# EAGLE design ESC_BOARD (EAGLE 9.6.2)

## Sheet 1 of 2
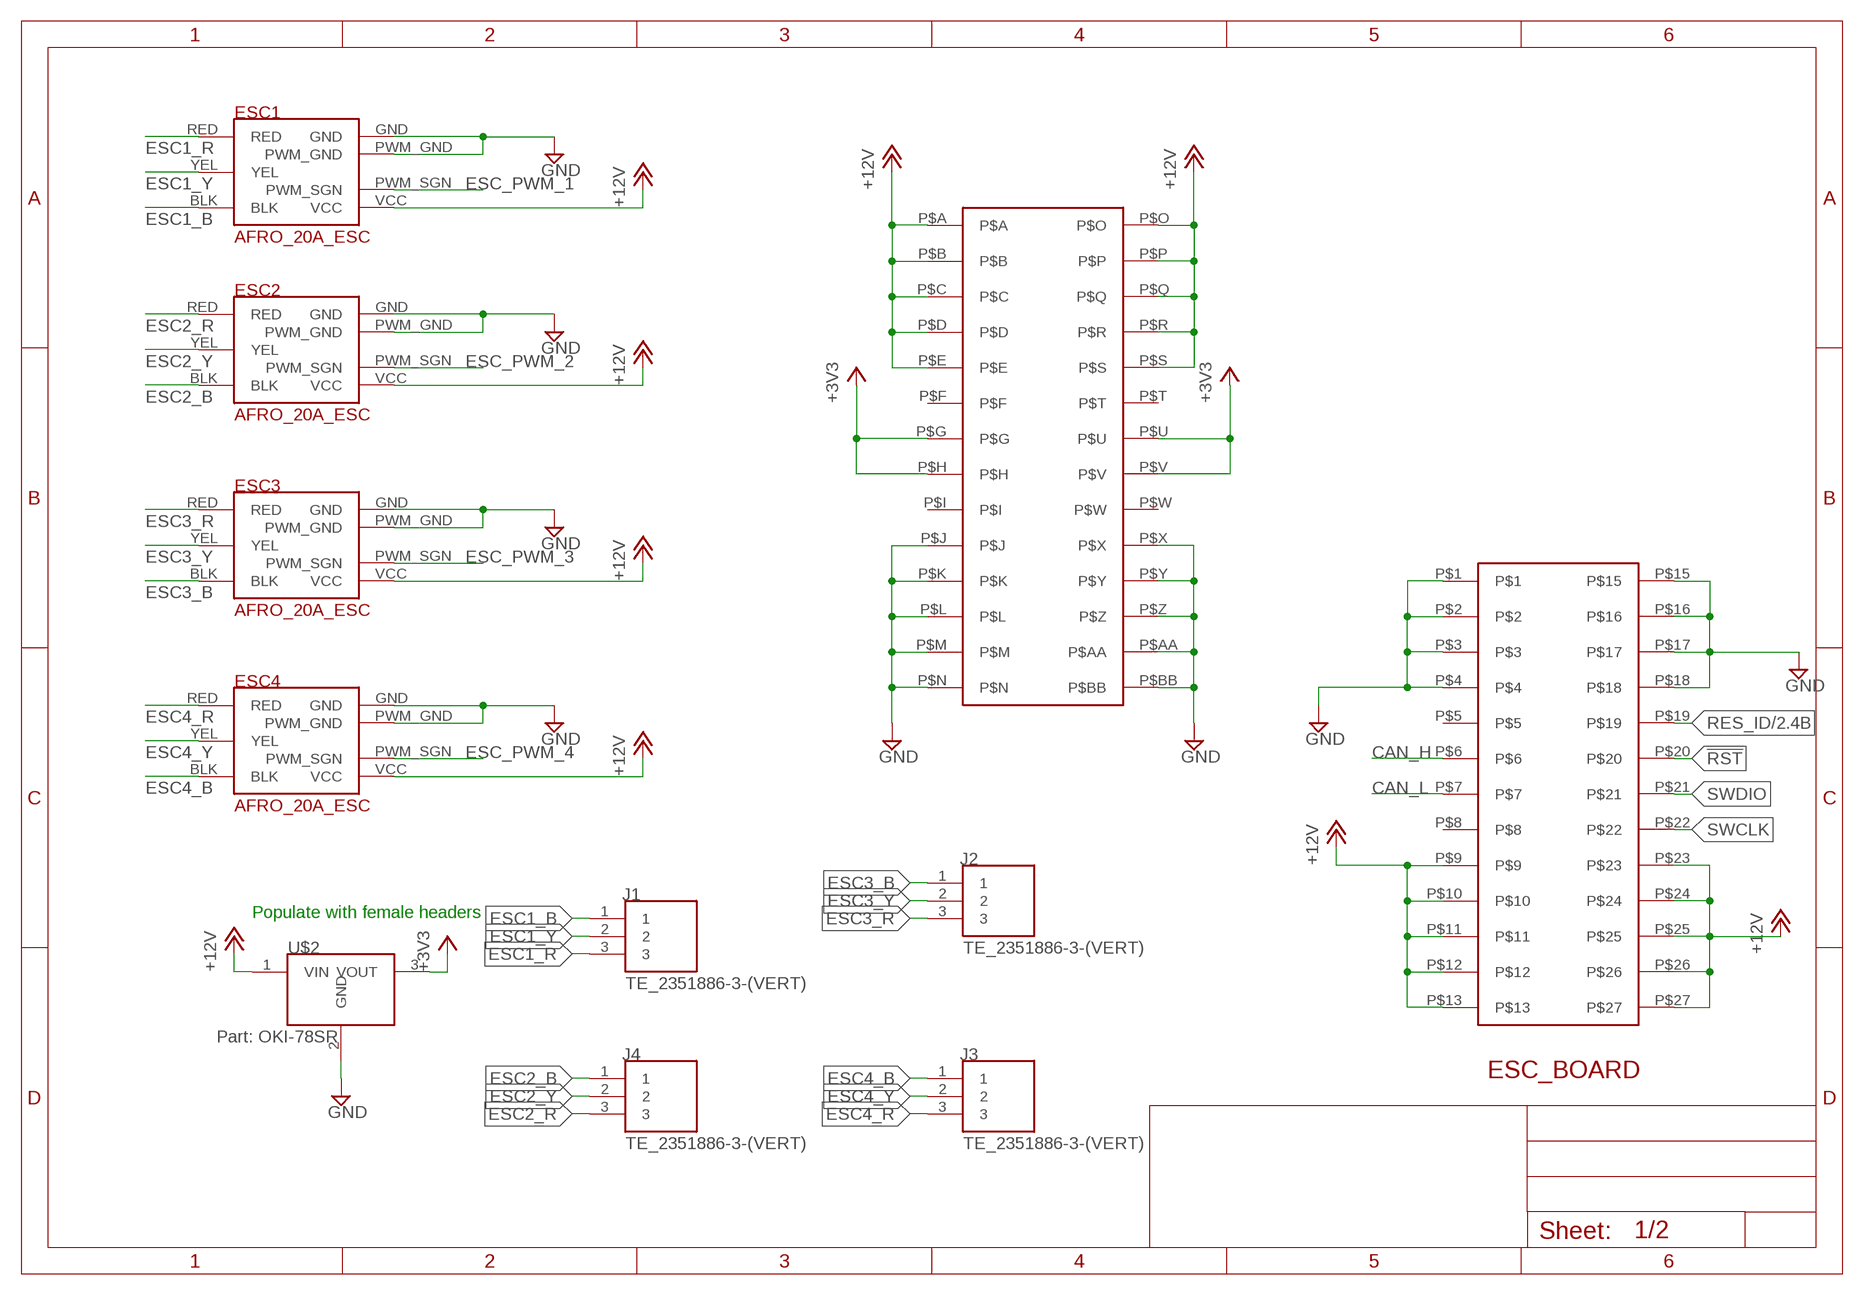
[diagram p0: schematic, sheet 1]

### Parts
ESC1  AFRO_20A_ESC  [AFRO_20A_ESC]
ESC2  AFRO_20A_ESC  [AFRO_20A_ESC]
ESC3  AFRO_20A_ESC  [AFRO_20A_ESC]
ESC4  AFRO_20A_ESC  [AFRO_20A_ESC]
J1  TE_2351886-3-(VERT)  [TE_2351886-3-(VERT)]
J2  TE_2351886-3-(VERT)  [TE_2351886-3-(VERT)]
J3  TE_2351886-3-(VERT)  [TE_2351886-3-(VERT)]
J4  TE_2351886-3-(VERT)  [TE_2351886-3-(VERT)]
U$2  MURATA-DC-DC  [MURATA-DC-DC]
U$6  ESC2BACKPLANE  [ESC2BACKPLANE_WHOLE]

### Nets
!RST [gpio]: U$6.P$20 ; also sheet 2
+3V3 [3.3V power]: U$2.3(VOUT) U$6.P$G U$6.P$H U$6.P$U U$6.P$V ; also sheet 2
+12V [12V power]: ESC1.VCC ESC2.VCC ESC3.VCC ESC4.VCC U$2.1(VIN) U$6.P$9 U$6.P$10 U$6.P$11 U$6.P$12 U$6.P$13 U$6.P$23 U$6.P$24 U$6.P$25 U$6.P$26 U$6.P$27 U$6.P$A U$6.P$B U$6.P$C U$6.P$D U$6.P$E U$6.P$O U$6.P$P U$6.P$Q U$6.P$R U$6.P$S
CAN_H [diff]: U$6.P$6 ; also sheet 2
CAN_L [diff]: U$6.P$7 ; also sheet 2
ESC1_B [motor phase]: ESC1.BLK J1.1
ESC1_R [motor phase]: ESC1.RED J1.3
ESC1_Y [motor phase]: ESC1.YEL J1.2
ESC2_B [motor phase]: ESC2.BLK J4.1
ESC2_R [motor phase]: ESC2.RED J4.3
ESC2_Y [motor phase]: ESC2.YEL J4.2
ESC3_B [motor phase]: ESC3.BLK J2.1
ESC3_R [motor phase]: ESC3.RED J2.3
ESC3_Y [motor phase]: ESC3.YEL J2.2
ESC4_B [motor phase]: ESC4.BLK J3.1
ESC4_R [motor phase]: ESC4.RED J3.3
ESC4_Y [motor phase]: ESC4.YEL J3.2
ESC_PWM_1 [gpio]: ESC1.PWM_SGN ; also sheet 2
ESC_PWM_2 [gpio]: ESC2.PWM_SGN ; also sheet 2
ESC_PWM_3 [gpio]: ESC3.PWM_SGN ; also sheet 2
ESC_PWM_4 [gpio]: ESC4.PWM_SGN ; also sheet 2
GND: ESC1.GND ESC1.PWM_GND ESC2.GND ESC2.PWM_GND ESC3.GND ESC3.PWM_GND ESC4.GND ESC4.PWM_GND U$2.2(GND) U$6.P$1 U$6.P$2 U$6.P$3 U$6.P$4 U$6.P$15 U$6.P$16 U$6.P$17 U$6.P$18 U$6.P$AA U$6.P$BB U$6.P$J U$6.P$K U$6.P$L U$6.P$M U$6.P$N U$6.P$X U$6.P$Y U$6.P$Z ; also sheet 2
RES_ID [gpio]: U$6.P$19 ; also sheet 2
SWCLK [gpio]: U$6.P$22 ; also sheet 2
SWDIO [gpio]: U$6.P$21 ; also sheet 2
Unconnected: U$6.P$5 U$6.P$8 U$6.P$F U$6.P$I U$6.P$T U$6.P$W

### Notes on the sheet
- Populate with female headers

## Sheet 2 of 2
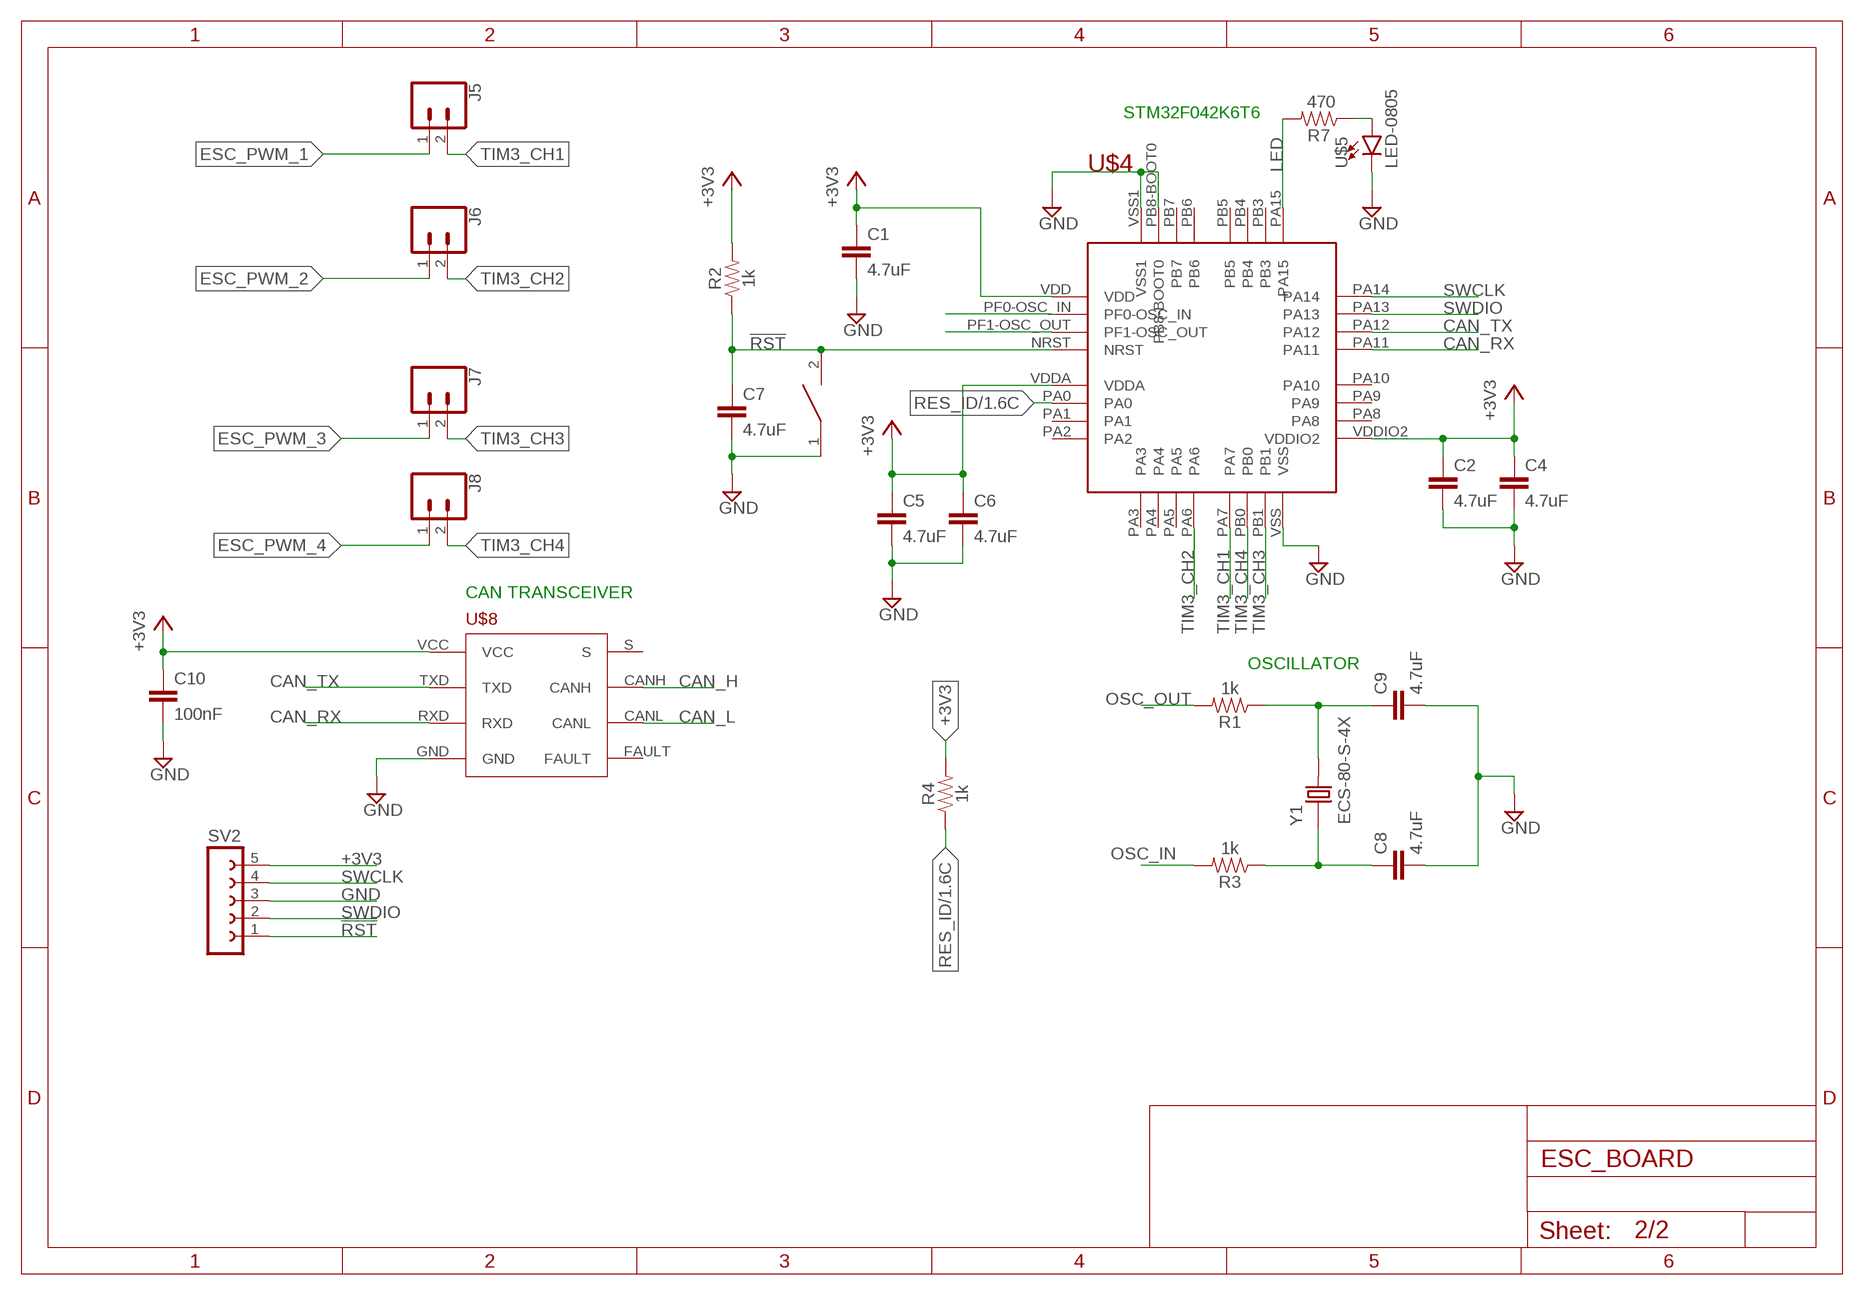
[diagram p1: schematic, sheet 2]

### Parts
C1  4.7uF  4.7UF0603  [0603]
C2  4.7uF  4.7UF0603  [0603]
C4  4.7uF  4.7UF0603  [0603]
C5  4.7uF  4.7UF0603  [0603]
C6  4.7uF  4.7UF0603  [0603]
C7  4.7uF  4.7UF0603  [0603]
C8  4.7uF  4.7UF0603  [0603]
C9  4.7uF  4.7UF0603  [0603]
C10  100nF  4.7UF0603  [0603]
J5  CONN_02  [1X02]
J6  CONN_02  [1X02]
J7  CONN_02  [1X02]
J8  CONN_02  [1X02]
R1  1k  1KOHM-0603-1/10W-1%  [0603]
R2  1k  1KOHM-0603-1/10W-1%  [0603]
R3  1k  1KOHM-0603-1/10W-1%  [0603]
R4  1k  1KOHM-0603-1/10W-1%  [0603]
R7  470  RESISTOR0603  [0603]
SV2  FE05-1  [FE05-1]
U$3  DISCRETECOMPONENTS_SWITCH  [DISCRETECOMPONENTS_SW_2512]
U$4  STM32F042K6T6  [STM32F042K6T6]
U$5  LED-0805  [0805]
U$8  TCAN337D  [TCAN337D]
Y1  ECS-80-S-4X  [XTAL_ECS-80-S-4X]

### Nets
!RST [gpio]: C7.1 R2.1 SV2.1 U$3.2 U$4.NRST ; also sheet 1
+3V3 [3.3V power]: C1.1 C2.1 C4.1 C5.1 C6.1 C10.1 R2.2 R4.2 SV2.5 U$4.VDD U$4.VDDA U$4.VDDIO2 U$8.VCC ; also sheet 1
CAN_H [diff]: U$8.CANH ; also sheet 1
CAN_L [diff]: U$8.CANL ; also sheet 1
CAN_RX [gpio]: U$4.PA11 U$8.RXD
CAN_TX [gpio]: U$4.PA12 U$8.TXD
ESC_PWM_1 [gpio]: J5.1 ; also sheet 1
ESC_PWM_2 [gpio]: J6.1 ; also sheet 1
ESC_PWM_3 [gpio]: J7.1 ; also sheet 1
ESC_PWM_4 [gpio]: J8.1 ; also sheet 1
GND: C1.2 C2.2 C4.2 C5.2 C6.2 C7.2 C8.2 C9.2 C10.2 SV2.3 U$3.1 U$4.PB8-BOOT0 U$4.VSS U$4.VSS1 U$5.C U$8.GND ; also sheet 1
LED [gpio]: R7.2 U$4.PA15
N$1: C9.1 R1.1 Y1.2
N$2: C8.1 R3.1 Y1.1
N$24: R7.1 U$5.A
OSC_IN [gpio]: R3.2 U$4.PF0-OSC_IN
OSC_OUT [gpio]: R1.2 U$4.PF1-OSC_OUT
RES_ID [gpio]: R4.1 U$4.PA0 ; also sheet 1
SWCLK [gpio]: SV2.4 U$4.PA14 ; also sheet 1
SWDIO [gpio]: SV2.2 U$4.PA13 ; also sheet 1
TIM3_CH1 [gpio]: J5.2 U$4.PA7
TIM3_CH2 [gpio]: J6.2 U$4.PA6
TIM3_CH3 [gpio]: J7.2 U$4.PB1
TIM3_CH4 [gpio]: J8.2 U$4.PB0
Unconnected: U$4.PA1 U$4.PA2 U$4.PA3 U$4.PA4 U$4.PA5 U$4.PA8 U$4.PA9 U$4.PA10 U$4.PB3 U$4.PB4 U$4.PB5 U$4.PB6 U$4.PB7 U$8.FAULT U$8.S

### Notes on the sheet
- STM32F042K6T6
- CAN TRANSCEIVER
- OSCILLATOR

## Library data of the parts
C1 C2 C4-C9 = SparkFun-Capacitors:4.7UF: 4.7µF ceramic capacitors A capacitor is a passive two-terminal electrical component used to store electrical energy temporarily in an electric field.; PROD_ID: CAP-08280
C10 = SparkFun-Capacitors:4.7UF: 4.7µF ceramic capacitors A capacitor is a passive two-terminal electrical component used to store electrical energy temporarily in an electric field.; PROD_ID: CAP-08280; VALUE: 4.7uF
ESC1-ESC4 = afro_20A_esc:AFRO_20A_ESC
J1-J4 = TE 3 pin 3.5mm:TE_2351886-3-(VERT)
J5-J8 = SparkFun-Connectors:CONN_02: Multi connection point. Often used as Generic Header-pin footprint for 0.1 inch spaced/style header connections On any of the 0.1 inch spaced packages, you can populate with these: Break Away Headers - Straight <https://www.sparkfun.com/products/116> (PRT-00116) Break Away Male Headers - Right Angle <https://www.sparkfun.com/products/553> (PRT-00553) Female Headers <https://www.sparkfun.com/products/115> (PRT-00115) Break Away Headers - Machine Pin <https://www.sparkfun.com/products/117> (PRT-00117) Break Away Female Headers - Swiss Machine Pin <https://www.sparkfun.com/products/743> (PRT-00743) For SCREWTERMINALS and SPRING TERMINALS visit here: Screw Terimnals on SparkFun.com <https://www.sparkfun.com/search/results?term=Screw+Terminals> (5mm/3.5mm/2.54mm spacing) This device is also useful as a general connection point to wire up your design to another part of your project. Our various solder wires solder well into these plated through hole pads. Hook-Up Wire - Assortment (Stranded, 22 AWG) <https://www.sparkfun.com/products/11375> (PRT-11375) Hook-Up Wire - Assortment (Solid Core, 22 AWG) <https://www.sparkfun.com/products/11367> (PRT-11367) View the entire wire category on our website here <https://www.sparkfun.com/categories/141> Special notes: Molex polarized connector foot print use with: PRT-08233 with associated crimp pins and housings. 2.54_SCREWTERM for use with PRT-10571. 3.5mm Screw Terminal footprints for PRT-08084 5mm Screw Terminal footprints for use with PRT-08432
R1-R4 = SparkFun-Resistors:1KOHM: 1kΩ resistor A resistor is a passive two-terminal electrical component that implements electrical resistance as a circuit element. Resistors act to reduce current flow, and, at the same time, act to lower voltage levels within circuits. - Wikipedia; PROD_ID: RES-07856
R7 = SparkFun-Resistors:RESISTOR: Generic Resistor Package
SV2 = con-lsta:FE05-1: FEMALE HEADER; OC_FARNELL: unknown; OC_NEWARK: unknown
U$2 = MURATA_3pin_dcdc:MURATA-DC-DC
U$3 = Push button - FSM2JMTR:DISCRETECOMPONENTS_SWITCH
U$4 = PI_Shield_Library:STM32F042K6T6
U$5 = LED-0805:LED-0805
U$6 = ESC_to_Backplane_Connectors_esc:ESC2BACKPLANE
U$8 = PI_Shield_Library:TCAN337D
Y1 = ECS-80-S-4X:ECS-80-S-4X: CRYSTAL T/H; DESCRIPTION: Crystal 8MHz Series 2-Pin HC-49/U; DIGI-KEY_PART_NUMBER: X1057-ND; DIGI-KEY_PURCHASE_URL: https://www.digikey.com/product-detail/en/ecs-inc/ECS-80-S-4X/X1057-ND/827549?utm_source=snapeda&utm_medium=aggregator&utm_campaign=symbol; MF: ECS International; MP: ECS-80-S-4X; PACKAGE: HC-49/US ECS International

## Net classes
1 gpio: width 0.203 mm
2 diff: width 0.203 mm, clearance 0.203 mm
3 3.3V power: width 0.61 mm
4 motor phase: width 1.778 mm
5 12V power: width 0.508 mm, clearance 0.508 mm

## Board
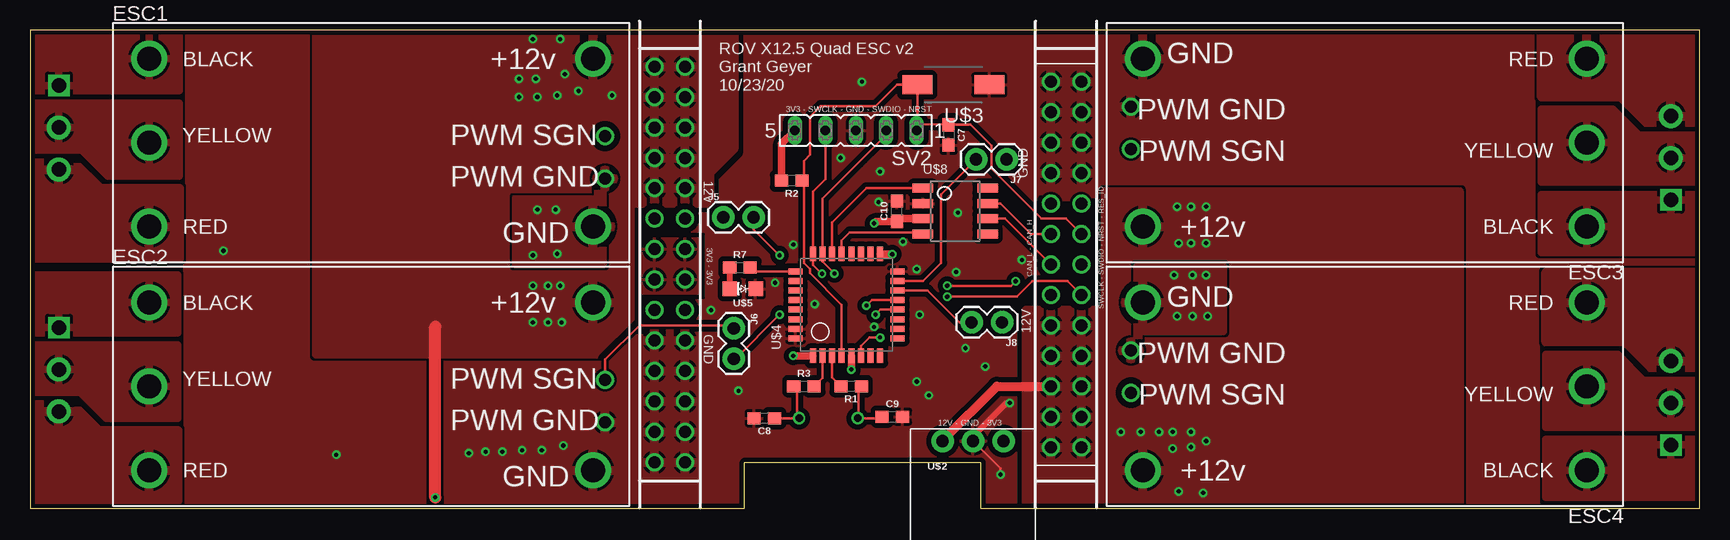
[diagram p2: board, top side]
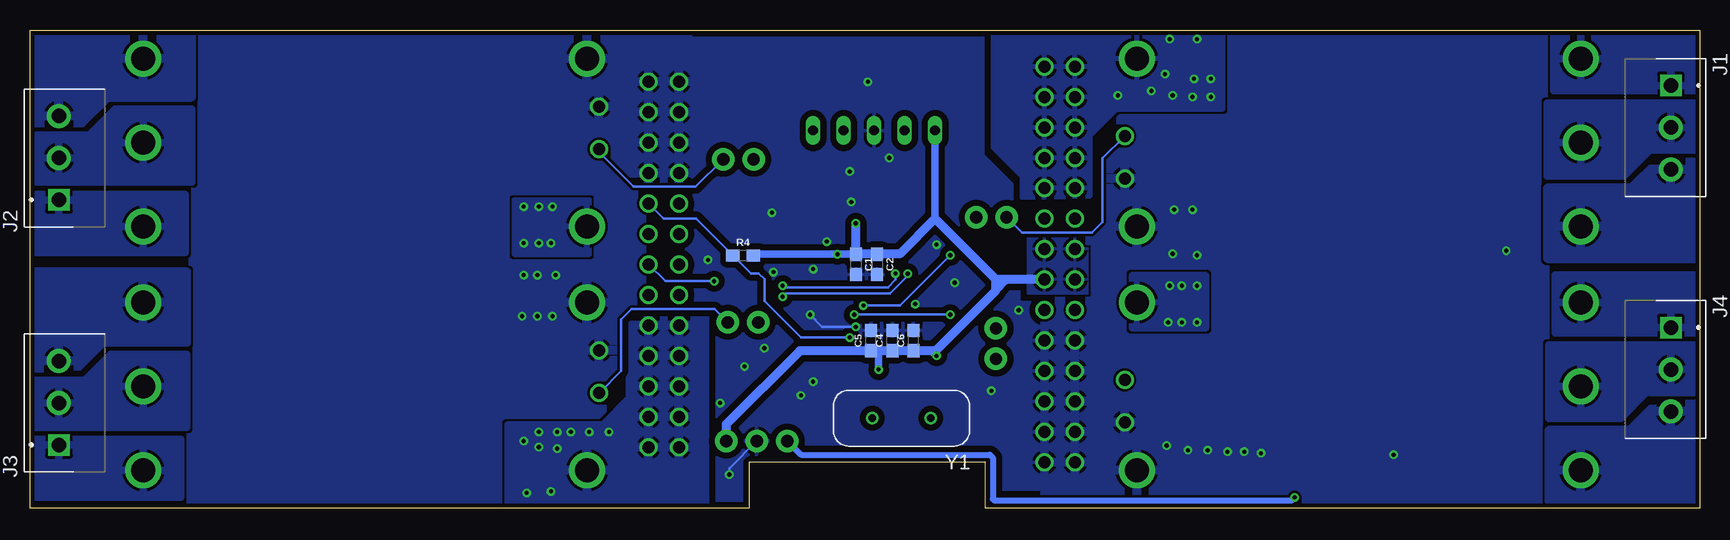
[diagram p3: board, bottom side, seen from below]

Size 139.19 x 39.88 mm. Coordinates in mm from the lower left corner, seen from the top.
Outline: 0,0 59.56,0 59.56,3.81 79.25,3.81 79.25,0 139.19,0 139.19,39.88 0,39.88 0,0
Copper layers (1*16): Top 0.0356mm / dielectric 1.5011mm / Bottom 0.0356mm
Design rules "ECE_Senior_Design": minimum track width 8mil, minimum drill 13mil, track to track 8mil, track to pad 8mil, pad to pad 6mil, via to via 8mil, smd to smd 6mil, copper to edge 15mil, drill to drill 8mil, minimum pad ring 7mil, minimum via ring 7mil, stop-mask expansion 3mil, vias tented up to drill 0mil, thermal gap 10mil

### Footprints (pad centres in the part's own frame; a part is rotated, then mirrored left to right if it is on the bottom)
0603 = smd 1.1 x 1: 1 -0.85,0; 2 0.85,0
AFRO_20A_ESC = drill 2: BLK -18,7; GND 19,-7; RED -18,-7; VCC 19,7; YEL -18,0 | drill 1: PWM_GND 20,-3; PWM_SGN 20,0.54
TE_2351886-3-(VERT) = drill 1.2 square: 1 -3.5,0 | drill 1.2 pad 2: 2 0,0; 3 3.5,0
1X02 = drill 1.016 pad 1.88: 1 0,0; 2 2.54,0
FE05-1 = drill 0.813 long: 1 -5.08,0; 2 -2.54,0; 3 0,0; 4 2.54,0; 5 5.08,0
MURATA-DC-DC = drill 1.016 pad 1.88: 1 -2.54,0; 2 0,0; 3 2.54,0
DISCRETECOMPONENTS_SW_2512 = smd 2.5 x 1.6: 1 -3,0; 2 3,0
STM32F042K6T6 = smd 1.2 x 0.5: NRST 0,3.2; PA0 0,1.6; PA1 0,0.8; PA2 0,0; PA8 8.5,0.8; PA9 8.5,1.6; PA10 8.5,2.4; PA11 8.5,3.2; PA12 8.5,4; PA13 8.5,4.8; PA14 8.5,5.6; PF0-OSC_IN 0,4.8; PF1-OSC_OUT 0,4; VDD 0,5.6; VDDA 0,2.4; VDDIO2 8.5,0 | smd 0.5 x 1.2: PA3 1.45,-1.45; PA4 2.25,-1.45; PA5 3.05,-1.45; PA6 3.85,-1.45; PA7 4.65,-1.45; PA15 7.05,7.05; PB0 5.45,-1.45; PB1 6.25,-1.45; PB3 6.25,7.05; PB4 5.45,7.05; PB5 4.65,7.05; PB6 3.85,7.05; PB7 3.05,7.05; PB8-BOOT0 2.25,7.05; VSS 7.05,-1.45; VSS1 1.45,7.05
0805 = smd 1.2 x 1.2: A 1.1,0; C -1.05,0
ESC2BACKPLANE_WHOLE = drill 1: P$1 1.27,31.75; P$2 3.81,31.75; P$3 6.35,31.75; P$4 8.89,31.75; P$5 11.43,31.75; P$6 13.97,31.75; P$7 16.51,31.75; P$8 19.05,31.75; P$9 21.59,31.75; P$10 24.13,31.75; P$11 26.67,31.75; P$12 29.21,31.75; P$13 31.75,31.75; P$15 1.27,34.29; P$16 3.81,34.29; P$17 6.35,34.29; P$18 8.89,34.29; P$19 11.43,34.29; P$20 13.97,34.29; P$21 16.51,34.29; P$22 19.05,34.29; P$23 21.59,34.29; P$24 24.13,34.29; P$25 26.67,34.29; P$26 29.21,34.29; P$27 31.75,34.29; P$A 0,-1.27; P$AA 30.48,1.27; P$B 2.54,-1.27; P$BB 33.02,1.27; P$C 5.08,-1.27; P$D 7.62,-1.27; P$E 10.16,-1.27; P$F 12.7,-1.27; P$G 15.24,-1.27; P$H 17.78,-1.27; P$I 20.32,-1.27; P$J 22.86,-1.27; P$K 25.4,-1.27; P$L 27.94,-1.27; P$M 30.48,-1.27; P$N 33.02,-1.27; P$O 0,1.27; P$P 2.54,1.27; P$Q 5.08,1.27; P$R 7.62,1.27; P$S 10.16,1.27; P$T 12.7,1.27; P$U 15.24,1.27; P$V 17.78,1.27; P$W 20.32,1.27; P$X 22.86,1.27; P$Y 25.4,1.27; P$Z 27.94,1.27
TCAN337D = smd 1.7 x 0.75: CANH 5.4,2.54; CANL 5.4,1.27; FAULT 5.4,0; GND 0,2.54; RXD 0,0; S 5.4,3.81; TXD 0,3.81; VCC 0,1.27
XTAL_ECS-80-S-4X = drill 0.63 pad 1.03: 1 -2.44,0; 2 2.44,0

### Placement (x,y rotation side)
C1  70.36,20.32 270 bottom
C2  68.58,20.32 270 bottom
C4  67.31,13.97 90 bottom
C5  69.09,13.97 90 bottom
C6  65.53,13.97 90 bottom
C7  76.58,31.11 270 top
C8  61.21,7.49 180 top
C9  71.88,7.62 0 top
C10  72.26,24.77 90 top
ESC1  27.94,30.48 0 top
ESC2  27.94,10.16 0 top
ESC3  111.76,30.48 180 top
ESC4  111.76,10.16 180 top
J1  2.41,31.75 270 bottom
J2  136.78,29.21 90 bottom
J3  136.78,8.76 90 bottom
J4  2.41,11.56 270 bottom
J5  57.78,24.26 0 top
J6  58.67,14.99 270 top
J7  81.41,29.08 180 top
J8  81.03,15.49 180 top
R1  68.45,10.16 180 top
R2  63.5,27.3 180 top
R3  64.52,10.16 0 top
R4  79.76,21.08 0 bottom
R7  59.18,20.07 0 top
SV2  68.83,31.5 180 top
U$2  78.61,5.59 0 top
U$3  76.96,35.31 180 top
U$4  70.87,12.7 90 top
U$5  59.44,18.29 180 top
U$6  53.34,36.83 270 top
U$8  74.42,22.86 0 top
Y1  66.55,7.49 180 bottom

### Tracks (layer width: path | path; a pad name or v marks a point on that pad's centre or on a via)
!RST
  Top 0.203: 64.52,27.47 64.52,28.96 65.02,29.46 65.02,32.64 65.91,33.53 70.48,33.53 72.26,35.31 U$3.2 73.96,31.54 SV2.1 74.42,32 C7.1 78.4,31.96 80.14,30.23 80.14,28.32 84.33,24.13 86.36,24.13 U$6.P$20 | 64.52,27.47 64.52,20.45 65.02,19.94 65.02,19.6 67.67,16.96 U$4.NRST | R2.1 64.52,27.47
+3V3  (via drill 0.35)
  Top 0.61: U$8.VCC 72.48,24.13 C10.1 70.52,23.91 v70.36,23.75 | U$4.VDD v63.63,12.7 | U$4.VDDIO2 71.85,21.2 v71.88,21.17 | U$4.VDDA 68.47,11.57 v68.45,11.56 | R2.2 62.65,30.39 SV2.5
  Bottom 0.61: C1.1 v71.88,21.17 78.82,21.17 R4.2 | SV2.5 63.75,24.13 | v63.63,12.7 64.05,13.12 64.6,13.12 | v68.45,11.56 68.45,13.12 | 57.78,19.05 58.67,18.16
  Bottom 0.762: U$2.3 81.15,6.99 75.02,13.12 C5.1 68.45,13.12 C4.1 C6.1 64.6,13.12 63.72,13.12 58.67,18.16 58.67,19.05 | v70.36,23.75 C1.1 C2.1 68.54,21.21 66.67,21.21 63.75,24.13 58.67,19.05 | U$6.P$V 57.78,19.05 58.67,19.05
  pour Top: 51.05,22.48 55.75,22.48 55.75,17.91 51.05,17.91
  pour Bottom: 56.01,22.48 51.05,22.48 51.05,17.91 56.01,17.91
+12V  (via drill 0.35)
  Top 0.762: U$2.1 76.07,5.63 80.6,10.16 U$6.P$11
  Top 1.016: v33.78,0.89 33.78,15.11
  Bottom 0.508: U$2.1 74.93,4.45 59.18,4.45 58.93,4.19 58.93,0.76 58.8,0.64 34.04,0.64 v33.78,0.89
  other vias: 44.2,39.12 44.58,36.2 42.16,35.81 42.29,34.29 45.72,34.8 90.93,6.35 92.58,6.35 94.11,6.35 95.25,6.35 96.77,6.35 96.77,5.08 95.25,4.95 95.76,1.4 40.77,34.29 40.77,35.81 43.94,34.42 48.51,34.42 41.91,39.12 98.04,5.59 97.79,1.27 44.2,18.54 43.18,18.54 41.91,18.54 41.91,15.49 43.18,15.49 44.32,15.49 95.76,22.1 96.77,22.1 98.04,22.1 98.04,25.15 96.77,25.15 95.63,25.15
  pour Top (isolate 0.406, rank 2): 23.88,40.89 58.67,40.89 58.67,29.97 56.64,27.94 56.64,25.4 50.04,25.4 50.04,15.24 47.62,12.83 23.88,12.83
  pour Top (isolate 0.406, rank 2): 83.06,16.51 89.66,16.51 89.66,26.42 119.13,26.42 119.13,-0.51 83.06,-0.51
  pour Bottom: 39.75,40.54 58.93,40.38 58.93,30.1 56.52,27.69 56.52,25.91 50.8,26.04 50.8,31.11 48.64,33.27 39.75,33.27
  pour Bottom: 82.93,16 89.15,16 89.15,9.14 91.44,6.86 99.31,6.86 99.31,-0.51 82.93,-0.51
  pour Bottom: 41.4,19.43 47.37,19.43 47.37,14.99 41.15,14.99 41.15,19.43 41.27,19.43
  pour Bottom: 98.55,21.21 92.58,21.21 92.58,25.65 98.81,25.65 98.81,21.21 98.68,21.21
CAN_H
  Top 0.203: U$8.CANH 80.9,25.4 83.44,22.86 U$6.P$6
CAN_L
  Top 0.203: U$8.CANL 81.28,24.13 U$6.P$7
CAN_RX
  Top 0.203: U$4.PA11 67.67,22.33 68.33,22.99 74.3,22.99 U$8.RXD
CAN_TX
  Top 0.203: U$4.PA12 66.87,23.81 69.72,26.67 U$8.TXD
ESC1_B
  pour Top: 12.45,34.8 -0.51,34.8 -0.51,39.62 12.45,39.62
  pour Bottom: 12.19,34.8 -0.76,34.8 -0.76,39.62 12.19,39.62
ESC1_R
  pour Bottom: 12.7,20.83 -0.25,20.83 -0.25,28.83 3.56,28.83 5.71,26.67 12.7,26.67
  pour Top: 12.45,20.83 -0.51,20.83 -0.51,28.83 3.68,28.83 5.84,26.67 12.45,26.67
ESC1_Y
  pour Bottom: 12.7,27.69 6.35,27.69 4.19,29.84 -0.25,29.84 -0.25,33.78 12.7,33.78
  pour Top: 12.45,27.69 6.48,27.69 4.32,29.84 -0.51,29.84 -0.51,33.78 12.45,33.78
ESC2_B
  pour Bottom: 12.06,14.61 -0.89,14.61 -0.89,19.43 12.06,19.43
  pour Top: 12.32,14.61 -0.64,14.61 -0.64,19.43 12.32,19.43
ESC2_R
  pour Top: 12.32,0.64 -0.64,0.64 -0.64,8.64 3.56,8.64 5.71,6.48 12.32,6.48
  pour Bottom: 12.57,0.64 -0.38,0.64 -0.38,8.64 3.68,8.64 5.84,6.48 12.57,6.48
ESC2_Y
  pour Top: 12.32,7.49 6.35,7.49 4.19,9.65 -0.64,9.65 -0.64,13.59 12.32,13.59
  pour Bottom: 12.57,7.49 6.6,7.49 4.45,9.65 -0.38,9.65 -0.38,13.59 12.57,13.59
ESC3_B
  pour Top: 125.98,26.16 138.94,26.16 138.94,21.34 125.98,21.34
  pour Bottom: 126.24,26.16 139.19,26.16 139.19,21.34 126.24,21.34
ESC3_R
  pour Top: 125.98,40.13 138.94,40.13 138.94,32.13 134.75,32.13 132.59,34.29 125.98,34.29
  pour Bottom: 125.73,40.13 138.68,40.13 138.68,32.13 134.87,32.13 132.72,34.29 125.73,34.29
ESC3_Y
  pour Top: 125.98,33.27 131.95,33.27 134.11,31.11 138.94,31.11 138.94,27.18 125.98,27.18
  pour Bottom: 125.73,33.27 132.08,33.27 134.24,31.11 138.68,31.11 138.68,27.18 125.73,27.18
ESC4_B
  pour Bottom: 126.62,5.71 139.57,5.71 139.57,0.89 126.62,0.89
  pour Top: 126.36,5.71 139.32,5.71 139.32,0.89 126.36,0.89
ESC4_R
  pour Bottom: 126.11,19.68 139.06,19.68 139.06,11.68 135.25,11.68 133.1,13.84 126.11,13.84
  pour Top: 126.36,19.68 139.32,19.68 139.32,11.68 135.13,11.68 132.97,13.84 126.36,13.84
ESC4_Y
  pour Top: 126.36,12.83 132.33,12.83 134.49,10.67 139.32,10.67 139.32,6.73 126.36,6.73
  pour Bottom: 126.11,12.83 132.46,12.83 134.62,10.67 139.06,10.67 139.06,6.73 126.11,6.73
ESC_PWM_1
  Bottom 0.203: ESC1.PWM_SGN 49.78,29.18 49.78,23.88 50.67,22.99 56.52,22.99 J5.1
ESC_PWM_2
  Top 0.203: ESC2.PWM_SGN 47.94,12.38 50.8,15.24 58.38,15.24 58.63,14.99 J6.1
ESC_PWM_3
  Bottom 0.203: ESC3.PWM_SGN 91.76,29.69 88.87,26.8 83.69,26.8 J7.1
ESC_PWM_4
  Bottom 0.203: ESC4.PWM_SGN 91.73,9.62 89.92,11.43 89.92,15.75 89.07,16.6 82.13,16.6 J8.1
GND  (via drill 0.35)
  Top 0.203: U$2.2 80.9,3.3 v80.9,2.79
  Top 0.508: U$2.2 78.61,5.99 81.38,8.76 v81.66,8.76
  Bottom 0.203: v70.36,15.11 73.15,15.11 v74.17,16.13 | U$2.2 80.9,3.3 v80.9,2.79
  other vias: 70.74,25.53 65.41,17.02 62.1,18.8 56.77,16.51 59.05,9.78 74.93,9.4 79.63,11.81 16.13,21.46 25.53,4.45 36.58,4.57 37.97,4.7 39.37,4.7 41.02,4.83 42.67,4.83 44.45,5.21 43.81,24.89 42.29,24.89 41.91,21.08 43.94,21.21 95.38,19.43 96.9,19.43 98.04,19.43 98.17,16 96.9,16 95.63,16 73.91,10.54 77.98,13.34 73.91,19.94 77.22,19.68 77.34,24.64 82.68,20.7 67.56,29.21 70.87,28.07 63.63,21.97 69.34,35.56 72.77,22.23
  pour Top (isolate 0.406, rank 6): 54.61,42.16 54.61,-1.02 85.85,-1.02 85.85,42.16
  pour Bottom (isolate 0.508, rank 6): 54.36,41.15 54.36,-1.52 85.85,-1.52 85.85,41.15
  pour Top: 92.58,19.94 99.19,19.94 99.19,14.99 92.58,14.99
  pour Top: 40.77,25.53 47.5,25.53 47.5,20.57 40.77,20.57
  pour Bottom (rank 6): 84.33,-2.29 84.33,41.4 143.13,41.4 143.13,-2.29
  pour Top (rank 6): 84.2,40.64 140.84,40.64 140.84,-1.27 84.2,-1.27
  pour Top (rank 6): -1.65,41.66 55.24,41.66 55.24,-2.29 -1.65,-2.29 -1.65,41.53
  pour Bottom (rank 6): -3.17,41.53 54.61,41.53 54.61,-1.27 -3.17,-1.27
LED
  Top 0.203: U$4.PA15 60.35,19.75 R7.2
N$1
  Top 0.203: C9.1 70.91,7.49 Y1.2 69.05,7.55 69.05,9.91 R1.1
N$2
  Top 0.203: R3.1 63.92,9.91 63.92,7.68 Y1.1 C8.1
N$24
  Top 0.508: R7.1 58.33,18.43 U$5.A
OSC_IN
  Top 0.203: U$4.PF0-OSC_IN 66.07,10.86 R3.2
OSC_OUT
  Top 0.203: R1.2 66.87,10.9 U$4.PF1-OSC_OUT
RES_ID  (via drill 0.35)
  Top 0.203: U$4.PA0 69.27,13.51 69.98,14.22 v70.87,14.22
  Bottom 0.203: v70.87,14.22 74.93,14.22 77.98,17.27 77.98,19.09 78.45,19.56 79.08,19.56 R4.1 83.65,24.13 86.36,24.13 U$6.P$19
SWCLK  (via drill 0.35)
  Top 0.203: SV2.4 66.29,27.43 65.27,26.4 U$4.PA14 65.27,20.29 v66.02,19.54 | v76.45,17.63 82.28,17.63 83.57,18.92 86.49,18.92 U$6.P$22
  Bottom 0.203: v76.45,17.63 76.18,17.91 67.5,17.91 66.02,19.39 v66.02,19.53 v66.02,19.54
SWDIO  (via drill 0.35)
  Top 0.203: SV2.2 71.37,31.11 66.07,25.81 U$4.PA13 66.07,20.55 v67.06,19.56 | v82.17,18.92 81.79,18.54 v76.45,18.54
  Bottom 0.203: v76.45,18.54 76.33,18.41 67.69,18.41 67.06,19.05 v67.06,19.56 | v82.17,18.92 86.23,18.92 U$6.P$21
TIM3_CH1  (via drill 0.35)
  Top 0.203: U$4.PA7 70.18,17.35 v69.72,16.89 | J5.2 60.33,23.24 v62.48,21.08
  Bottom 0.203: v62.48,21.08 66.67,16.89 v69.72,16.89
TIM3_CH2  (via drill 0.35)
  Top 0.203: v70.48,16.13 70.91,16.55 U$4.PA6 | v62.48,16.13 58.8,12.45 J6.2
  Bottom 0.203: v70.48,16.13 v62.48,16.13
TIM3_CH3
  Top 0.203: U$4.PB1 74.45,18.95 75.95,20.45 75.95,26.04 75.95,26.16 J7.2
TIM3_CH4
  Top 0.203: U$4.PB0 74.81,18.15 77.47,15.49 J8.2

### Text on the board
tPlace: ROV X12.5 Quad ESC v2 / Grant Geyer / 10/23/20
tNames: 3V3 - SWCLK - GND - SWDIO - NRST | GND | 12v | 3V3 - 3V3 | CAN_L - CAN_H | SWCLK - SWDIO - NRST - RES_ID | 12V | GND | 12V - GND - 3V3